# Altium schematic sheet Sensors.SchDoc
size A4
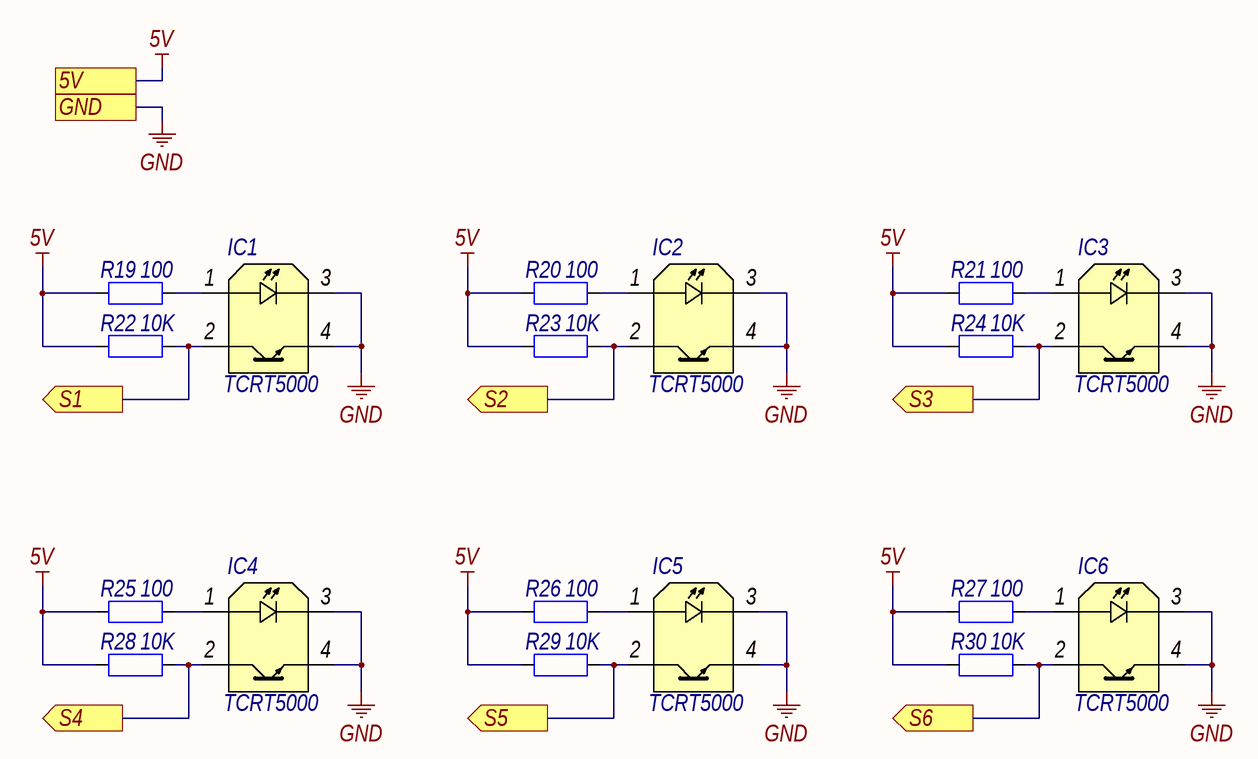
[diagram p0: Sensors.SchDoc]

## Parts
IC1  TCRT5000  [TCRT5000]
IC2  TCRT5000  [TCRT5000]
IC3  TCRT5000  [TCRT5000]
IC4  TCRT5000  [TCRT5000]
IC5  TCRT5000  [TCRT5000]
IC6  TCRT5000  [TCRT5000]
R19  100  [R0805]
R20  100  [R0805]
R21  100  [R0805]
R22  10K  [R0805]
R23  10K  [R0805]
R24  10K  [R0805]
R25  100  [R0805]
R26  100  [R0805]
R27  100  [R0805]
R28  10K  [R0805]
R29  10K  [R0805]
R30  10K  [R0805]

## Ports
5V, GND, S1 (out), S2 (out), S3 (out), S4 (out), S5 (out), S6 (out)

## Nets
5V: R19.2 R20.2 R21.2 R22.2 R23.2 R24.2 R25.2 R26.2 R27.2 R28.2 R29.2 R30.2 ; port 5V
GND: IC1.3(C) IC1.4(E) IC2.3(C) IC2.4(E) IC3.3(C) IC3.4(E) IC4.3(C) IC4.4(E) IC5.3(C) IC5.4(E) IC6.3(C) IC6.4(E) ; port GND
S1: IC1.2(C) R22.1 ; port S1
S2: IC2.2(C) R23.1 ; port S2
S3: IC3.2(C) R24.1 ; port S3
S4: IC4.2(C) R28.1 ; port S4
S5: IC5.2(C) R29.1 ; port S5
S6: IC6.2(C) R30.1 ; port S6
NetIC1_1: IC1.1(A) R19.1
NetIC2_1: IC2.1(A) R20.1
NetIC3_1: IC3.1(A) R21.1
NetIC4_1: IC4.1(A) R25.1
NetIC5_1: IC5.1(A) R26.1
NetIC6_1: IC6.1(A) R27.1

## Library data of the parts
IC1-IC6 = TCRT5000: IR photointerrupter
R19-R30 = Resistor: Power rating: 2Вт
  R19-R21 R25-R27: Value: 100
  R22-R24 R28-R30: Value: 10K